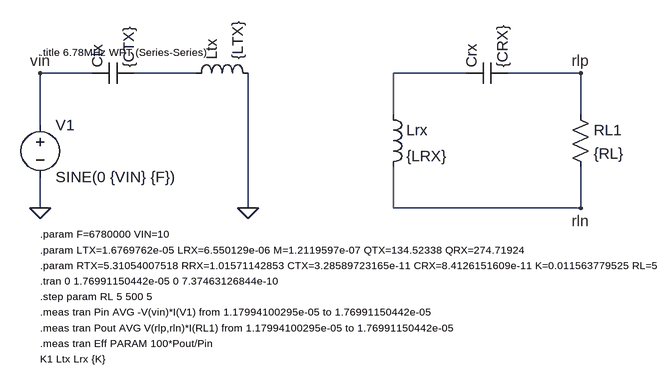
[diagram p0: schematic wpt_6p78mhz.asc]
wpt_6p78mhz.asc, the LTspice schematic file:
Version 4.1
SHEET 1 1200 800
WIRE 32 128 32 48
WIRE 112 48 32 48
WIRE 176 48 272 48
WIRE 352 48 352 256
WIRE 32 256 32 208
WIRE 576 112 576 48
WIRE 688 48 576 48
WIRE 752 48 864 48
WIRE 864 112 864 48
WIRE 576 256 576 192
WIRE 864 256 864 192
WIRE 864 256 576 256
FLAG 32 48 vin
FLAG 864 48 rlp
FLAG 864 256 rln
FLAG 32 256 0
FLAG 352 256 0
SYMBOL voltage 32 112 R0
WINDOW 123 56 124 Left 2
WINDOW 39 0 0 Left 0
SYMATTR InstName V1
SYMATTR Value SINE(0 {VIN} {F})
SYMBOL cap 112 64 R270
SYMATTR InstName Ctx
SYMATTR Value {CTX}
SYMBOL ind 256 64 R270
SYMATTR InstName Ltx
SYMATTR Value {LTX}
SYMATTR SpiceLine Rser={RTX}
SYMBOL ind 560 96 R0
SYMATTR InstName Lrx
SYMATTR Value {LRX}
SYMATTR SpiceLine Rser={RRX}
SYMBOL cap 688 64 R270
SYMATTR InstName Crx
SYMATTR Value {CRX}
SYMBOL res 848 96 R0
SYMATTR InstName RL1
SYMATTR Value {RL}
TEXT 32 16 Left 1 !.title 6.78MHz WPT (Series-Series)
TEXT 32 296 Left 1 !.param F=6780000 VIN=10
TEXT 32 320 Left 1 !.param LTX=1.6769762e-05 LRX=6.550129e-06 M=1.2119597e-07 QTX=134.52338 QRX=274.71924
TEXT 32 344 Left 1 !.param RTX=5.31054007518 RRX=1.01571142853 CTX=3.28589723165e-11 CRX=8.4126151609e-11 K=0.011563779525 RL=5
TEXT 32 368 Left 1 !.tran 0 1.76991150442e-05 0 7.37463126844e-10
TEXT 32 392 Left 1 !.step param RL 5 500 5
TEXT 32 416 Left 1 !.meas tran Pin AVG -V(vin)*I(V1) from 1.17994100295e-05 to 1.76991150442e-05
TEXT 32 440 Left 1 !.meas tran Pout AVG V(rlp,rln)*I(RL1) from 1.17994100295e-05 to 1.76991150442e-05
TEXT 32 464 Left 1 !.meas tran Eff PARAM 100*Pout/Pin
TEXT 32 488 Left 1 !K1 Ltx Lrx {K}

The netlist it stands for:
* wpt_6p78mhz.asc
V1 vin 0 SINE(0 {VIN} {F})
Ctx vin N001 {CTX}
Ltx N001 0 {LTX} Rser={RTX}
Lrx N002 rln {LRX} Rser={RRX}
Crx N002 rlp {CRX}
RL1 rlp rln {RL}
.title 6.78MHz WPT (Series-Series)
.param F=6780000 VIN=10
.param LTX=1.6769762e-05 LRX=6.550129e-06 M=1.2119597e-07 QTX=134.52338 QRX=274.71924
.param RTX=5.31054007518 RRX=1.01571142853 CTX=3.28589723165e-11 CRX=8.4126151609e-11 K=0.011563779525 RL=5
.tran 0 1.76991150442e-05 0 7.37463126844e-10
.step param RL 5 500 5
.meas tran Pin AVG -V(vin)*I(V1) from 1.17994100295e-05 to 1.76991150442e-05
.meas tran Pout AVG V(rlp,rln)*I(RL1) from 1.17994100295e-05 to 1.76991150442e-05
.meas tran Eff PARAM 100*Pout/Pin
K1 Ltx Lrx {K}
.backanno
.end